# EAGLE schematic NeoDigito Medio v2 (EAGLE 9.1.3)
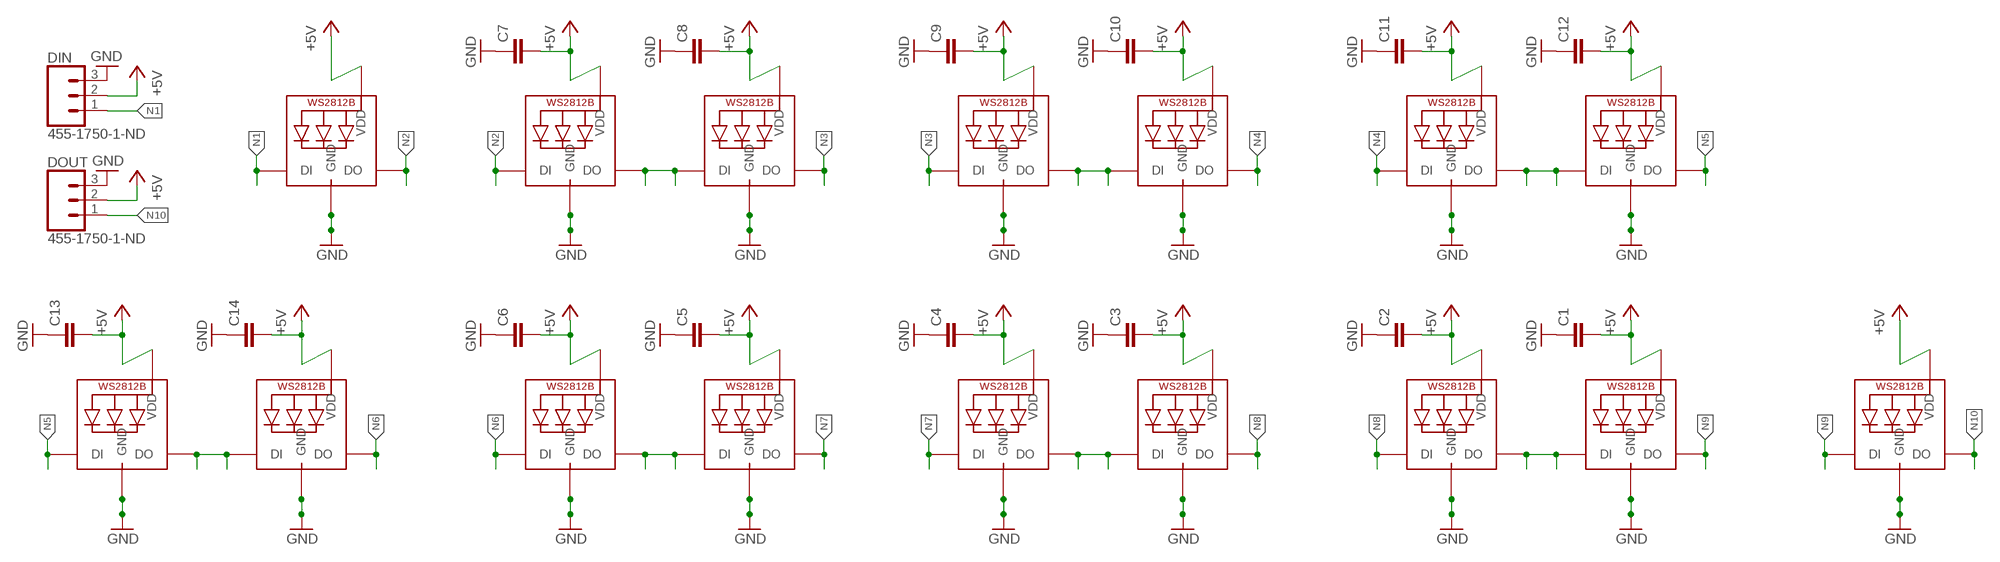
[diagram p0: schematic, sheet 1]

## Parts
C1  C-EUC0805  [C0805]
C2  C-EUC0805  [C0805]
C3  C-EUC0805  [C0805]
C4  C-EUC0805  [C0805]
C5  C-EUC0805  [C0805]
C6  C-EUC0805  [C0805]
C7  C-EUC0805  [C0805]
C8  C-EUC0805  [C0805]
C9  C-EUC0805  [C0805]
C10  C-EUC0805  [C0805]
C11  C-EUC0805  [C0805]
C12  C-EUC0805  [C0805]
C13  C-EUC0805  [C0805]
C14  C-EUC0805  [C0805]
DIN  455-1750-1-ND  CONN_03  [1X03]
DOUT  455-1750-1-ND  CONN_031X03_NO_SILK  [1X03_NO_SILK]
PA.  WS2812B3535  [LED3535]
PB.  WS2812B3535  [LED3535]
SA1.  WS2812B3535  [LED3535]
SA2.  WS2812B3535  [LED3535]
SB1.  WS2812B3535  [LED3535]
SB2.  WS2812B3535  [LED3535]
SC1.  WS2812B3535  [LED3535]
SC2.  WS2812B3535  [LED3535]
SD1.  WS2812B3535  [LED3535]
SD2.  WS2812B3535  [LED3535]
SE1.  WS2812B3535  [LED3535]
SE2.  WS2812B3535  [LED3535]
SF1.  WS2812B3535  [LED3535]
SF2.  WS2812B3535  [LED3535]
SG1.  WS2812B3535  [LED3535]
SG2.  WS2812B3535  [LED3535]

## Nets
+5V: C1.2 C2.2 C3.2 C4.2 C5.2 C6.2 C7.2 C8.2 C9.2 C10.2 C11.2 C12.2 C13.2 C14.2 DIN.2 DOUT.2 PA..2(VDD) PB..2(VDD) SA1..2(VDD) SA2..2(VDD) SB1..2(VDD) SB2..2(VDD) SC1..2(VDD) SC2..2(VDD) SD1..2(VDD) SD2..2(VDD) SE1..2(VDD) SE2..2(VDD) SF1..2(VDD) SF2..2(VDD) SG1..2(VDD) SG2..2(VDD)
GND: C1.1 C2.1 C3.1 C4.1 C5.1 C6.1 C7.1 C8.1 C9.1 C10.1 C11.1 C12.1 C13.1 C14.1 DIN.3 DOUT.3 PA..4(GND) PB..4(GND) SA1..4(GND) SA2..4(GND) SB1..4(GND) SB2..4(GND) SC1..4(GND) SC2..4(GND) SD1..4(GND) SD2..4(GND) SE1..4(GND) SE2..4(GND) SF1..4(GND) SF2..4(GND) SG1..4(GND) SG2..4(GND)
N1: DIN.1 PB..1(DI)
N2: PB..3(DO) SC1..1(DI)
N3: SC2..3(DO) SD1..1(DI)
N4: SD2..3(DO) SE1..1(DI)
N5: SE2..3(DO) SG1..1(DI)
N6: SB1..1(DI) SG2..3(DO)
N7: SA1..1(DI) SB2..3(DO)
N8: SA2..3(DO) SF1..1(DI)
N9: PA..1(DI) SF2..3(DO)
N10: DOUT.1 PA..3(DO)
N$1: SE1..3(DO) SE2..1(DI)
N$2: SC1..3(DO) SC2..1(DI)
N$3: SA1..3(DO) SA2..1(DI)
N$4: SF1..3(DO) SF2..1(DI)
N$5: SD1..3(DO) SD2..1(DI)
N$14: SG1..3(DO) SG2..1(DI)
N$17: SB1..3(DO) SB2..1(DI)

## Library data of the parts
C1-C14 = CCV1:C-EU: CAPACITOR, European symbol; SPICEPREFIX: C
DIN = CCV1:CONN_03: Multi connection point. Often used as Generic Header-pin footprint for 0.1 inch spaced/style header connections On any of the 0.1 inch spaced packages, you can populate with these: Break Away Headers - Straight <https://www.sparkfun.com/products/116> (PRT-00116) Break Away Male Headers - Right Angle <https://www.sparkfun.com/products/553> (PRT-00553) Female Headers <https://www.sparkfun.com/products/115> (PRT-00115) Break Away Headers - Machine Pin <https://www.sparkfun.com/products/117> (PRT-00117) Break Away Female Headers - Swiss Machine Pin <https://www.sparkfun.com/products/743> (PRT-00743) Stackable Header - 3 Pin (Female, 0.1") <https://www.sparkfun.com/products/13875> (PRT-13875) For SCREWTERMINALS and SPRING TERMINALS visit here: Screw Terimnals on SparkFun.com <https://www.sparkfun.com/search/results?term=Screw+Terminals> (5mm/3.5mm/2.54mm spacing) This device is also useful as a general connection point to wire up your design to another part of your project. Our various solder wires solder well into these plated through hole pads. Hook-Up Wire - Assortment (Stranded, 22 AWG) <https://www.sparkfun.com/products/11375> (PRT-11375) Hook-Up Wire - Assortment (Solid Core, 22 AWG) <https://www.sparkfun.com/products/11367> (PRT-11367) View the entire wire category on our website here <https://www.sparkfun.com/categories/141> Special notes: Molex polarized connector foot print use with SKU : PRT-08232 with associated crimp pins and housings.; PROD_ID: XXX-00000
DOUT = CCV1:CONN_03: Multi connection point. Often used as Generic Header-pin footprint for 0.1 inch spaced/style header connections On any of the 0.1 inch spaced packages, you can populate with these: Break Away Headers - Straight <https://www.sparkfun.com/products/116> (PRT-00116) Break Away Male Headers - Right Angle <https://www.sparkfun.com/products/553> (PRT-00553) Female Headers <https://www.sparkfun.com/products/115> (PRT-00115) Break Away Headers - Machine Pin <https://www.sparkfun.com/products/117> (PRT-00117) Break Away Female Headers - Swiss Machine Pin <https://www.sparkfun.com/products/743> (PRT-00743) Stackable Header - 3 Pin (Female, 0.1") <https://www.sparkfun.com/products/13875> (PRT-13875) For SCREWTERMINALS and SPRING TERMINALS visit here: Screw Terimnals on SparkFun.com <https://www.sparkfun.com/search/results?term=Screw+Terminals> (5mm/3.5mm/2.54mm spacing) This device is also useful as a general connection point to wire up your design to another part of your project. Our various solder wires solder well into these plated through hole pads. Hook-Up Wire - Assortment (Stranded, 22 AWG) <https://www.sparkfun.com/products/11375> (PRT-11375) Hook-Up Wire - Assortment (Solid Core, 22 AWG) <https://www.sparkfun.com/products/11367> (PRT-11367) View the entire wire category on our website here <https://www.sparkfun.com/categories/141> Special notes: Molex polarized connector foot print use with SKU : PRT-08232 with associated crimp pins and housings.
PA. PB. SA1. SA2. SB1. SB2. SC1. SC2. SD1. SD2. SE1. SE2. SF1. SF2. SG1. SG2. = adafruit:WS2812B